# Altium schematic sheet I2C-to-SPI.SchDoc
size A
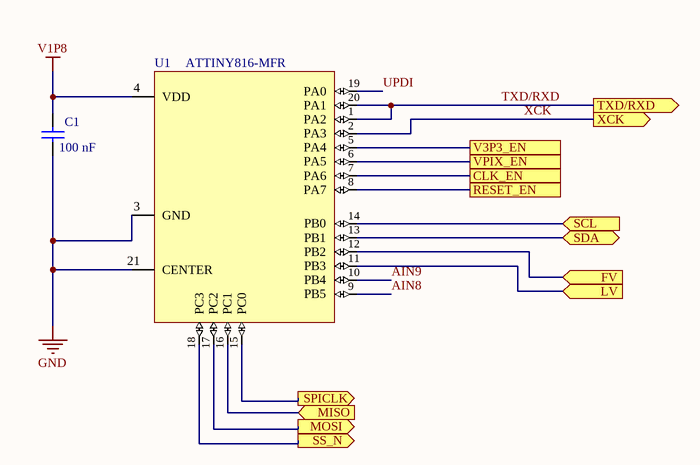
[diagram p0: I2C-to-SPI.SchDoc]

## Parts
C1  Capacitance: 100 nF  [PCB-v6eq6etc9p7u7qdkgnno-1]  (hidden comment: GRM033C71C104KE14D)
U1  ATTINY816-MFR  [PCB-hv4cq49t2e9uf1npj5by-1]

## Ports
CLK_EN, FV (in), LV (in), MISO (in), MOSI (out), RESET_EN, SCL (in), SDA (bidir), SPICLK (out), SS_N (out), TXD/RXD (out), V3P3_EN, VPIX_EN, XCK (out)

## Nets
GND: C1.1 U1.3(GND) U1.21(CENTER)
V1P8: C1.2 U1.4(VDD)
AIN8: U1.9(PB5)
AIN9: U1.10(PB4)
CLK_EN: U1.7(PA6) ; port CLK_EN
FV: U1.12(PB2) ; port FV
LV: U1.11(PB3) ; port LV
MISO: U1.16(PC1) ; port MISO
MOSI: U1.17(PC2) ; port MOSI
RESET_EN: U1.8(PA7) ; port RESET_EN
SCL: U1.14(PB0) ; port SCL
SDA: U1.13(PB1) ; port SDA
SPICLK: U1.15(PC0) ; port SPICLK
SS_N: U1.18(PC3) ; port SS_N
TXD/RXD: U1.1(PA2) U1.20(PA1) ; port TXD/RXD
UPDI: U1.19(PA0)
V3P3_EN: U1.5(PA4) ; port V3P3_EN
VPIX_EN: U1.6(PA5) ; port VPIX_EN
XCK: U1.2(PA3) ; port XCK

## Library data of the parts
C1 = CMP-cc290632c88a13ee-3: 0.1 µF ±10% 16V Ceramic Capacitor X7S 0201 (0603 Metric) /; Voltage Rating (DC): 16.0 V; Lead-Free Status: Lead Free; Size-Length: 600 µm; Capacitance Tolerance: ±10%; Size-Thickness: 300 µm; Packaging: Reel; OctopartID: cc290632c88a13ee; RoHS: Compliant; Case/Package: 0201; Size-Width: 300 µm; Manufacturer Part Number: GRM033C71C104KE14D; Dielectric Characteristic: X7S; Octopart URL: http://octopart.com/grm033c71c104ke14d-murata-51454405; Mounting Style: Surface Mount
U1 = CMP-1cb5d12d1e47c372-8: AVR series Microcontroller IC 8-Bit 16MHz 8KB (8K x 8) FLASH 20-VQFN (3x3); RAM Memory Size: 512 B; Clock Speed: 20.0 MHz; RoHS: Compliant; Manufacturer Part Number: ATTINY816-MFR; Octopart URL: http://octopart.com/attiny816-mfr-microchip-76687252